# Altium schematic sheet PCBA-2075-01.SchDoc
size Tabloid; ApprovedBy: N. Paiva; Organization: HEBI Robotics; Address1: 3577 Bigelow Blvd.; Address2: Floor 3; Address3: Pittsburgh, PA 15213; Address4: USA
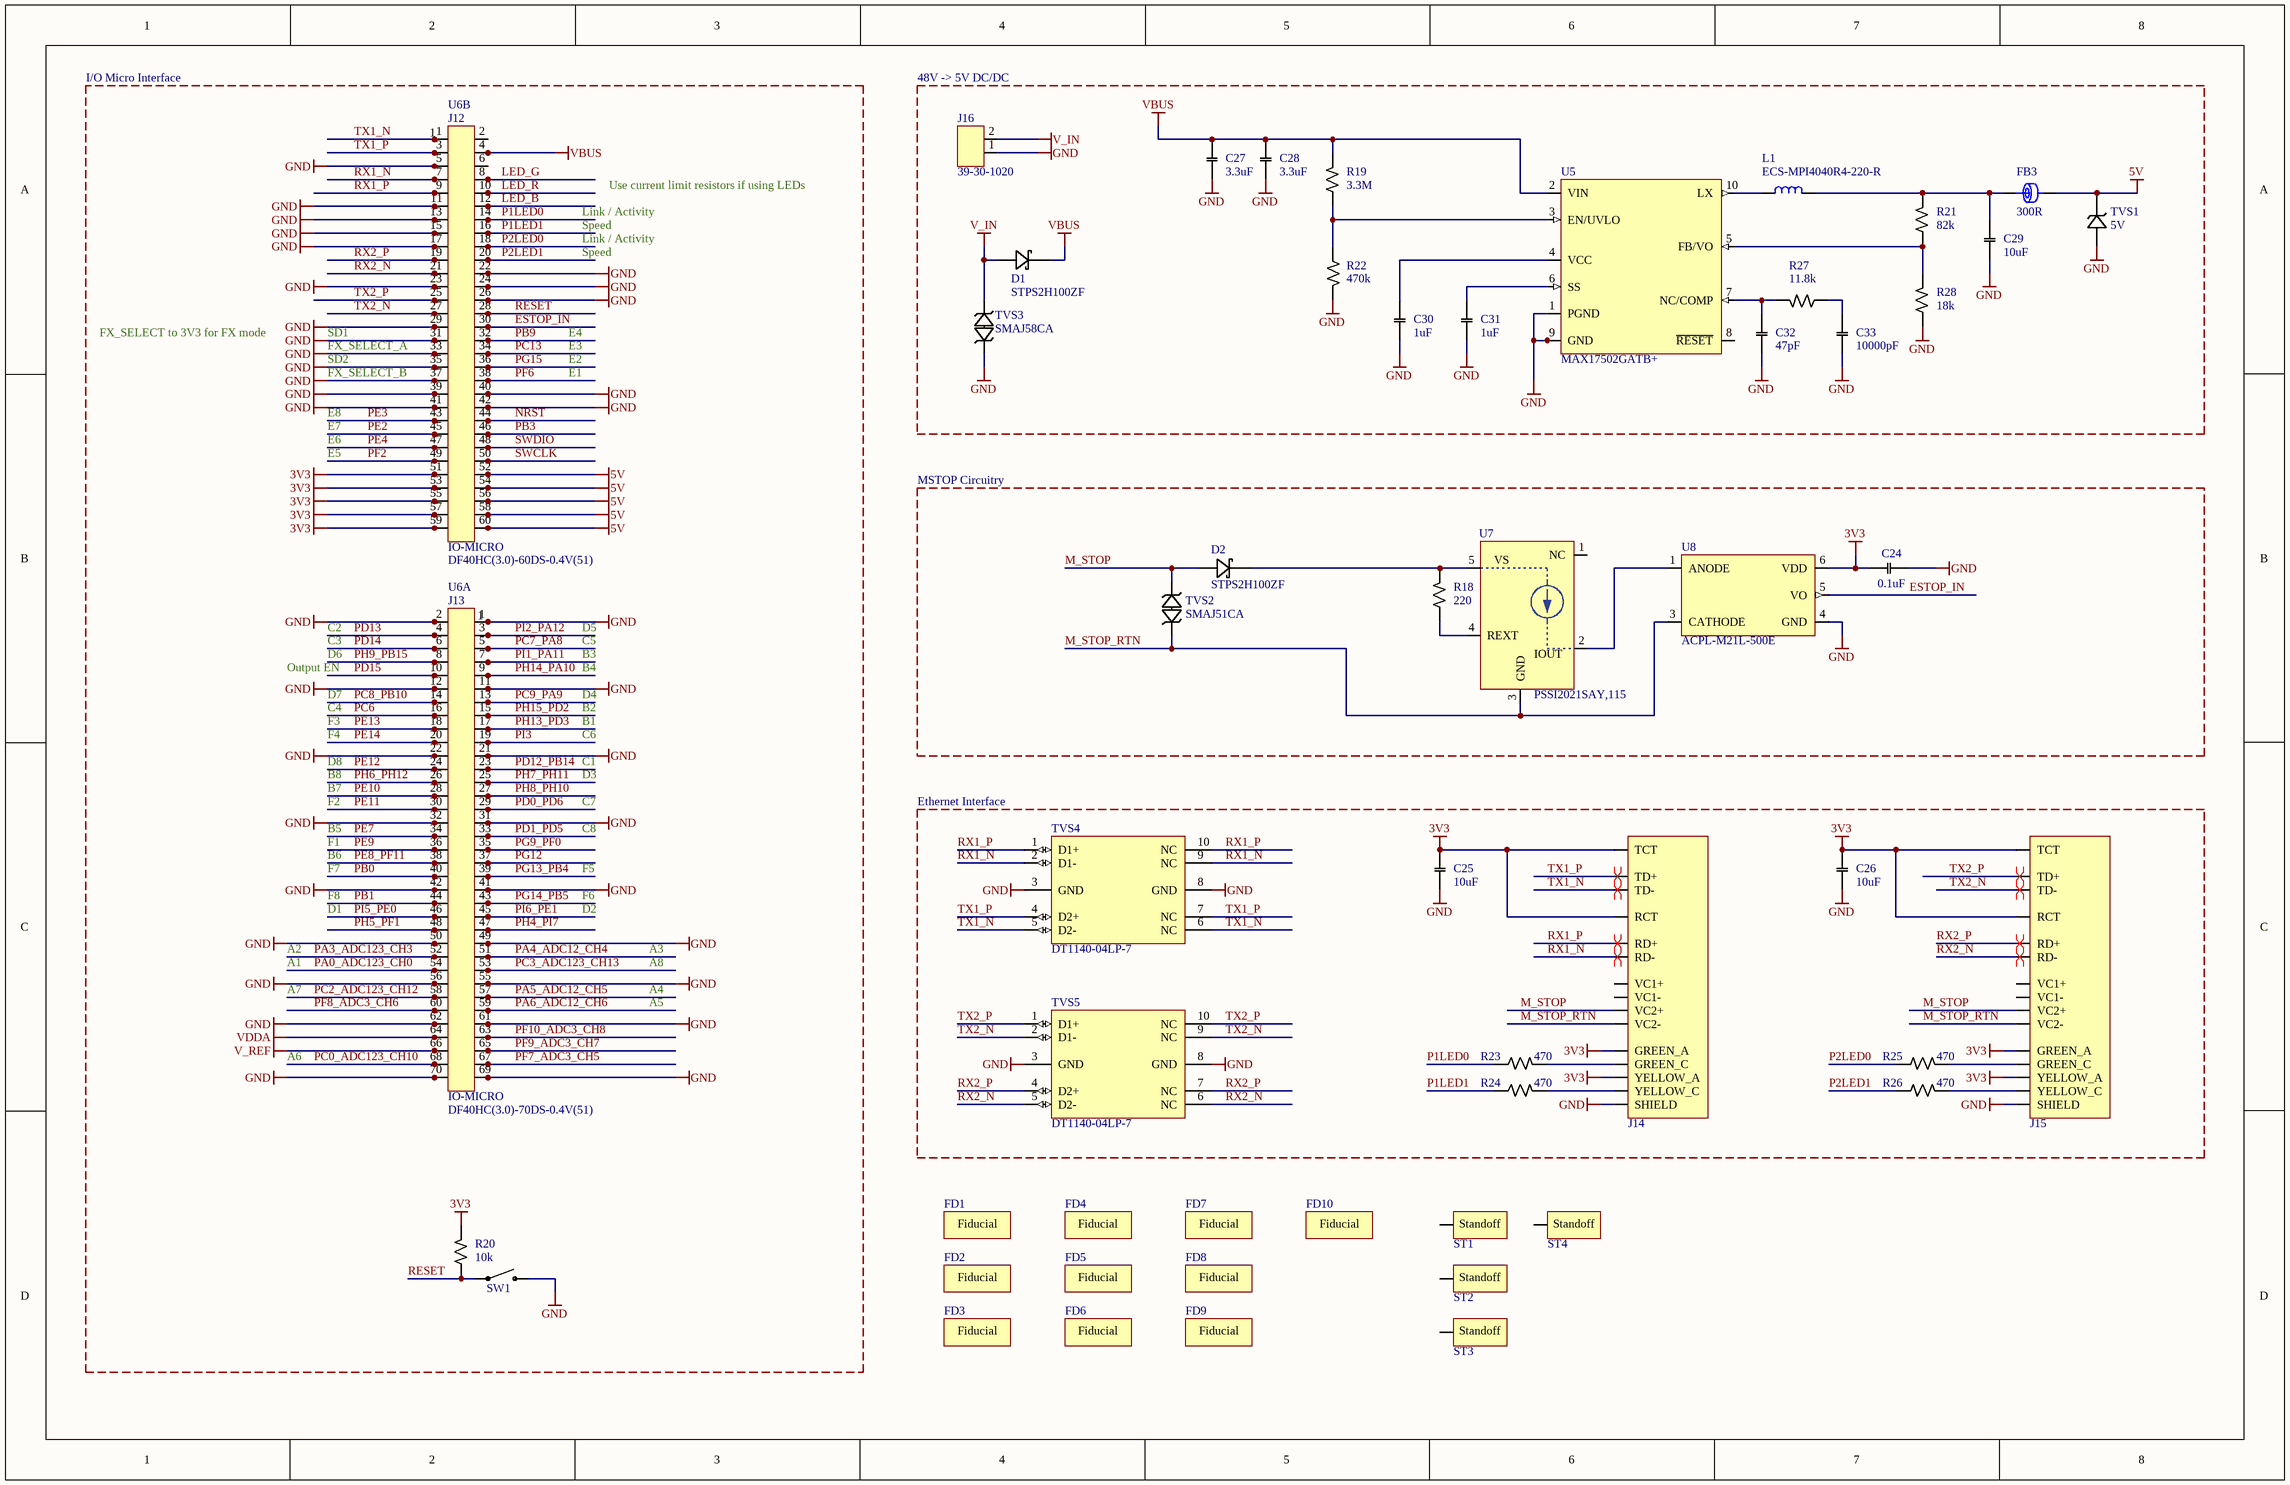
[diagram p0: PCBA-2075-01.SchDoc]

## Parts
C24  Capacitance: 0.1uF  [C0402]  (hidden comment: C-0.1uf-X7R-25V-10%-0402)
C25  Capacitance: 10uF  [C0805]  (hidden comment: C-10uf-X5R-25V-10%-0805)
C26  Capacitance: 10uF  [C0805]  (hidden comment: C-10uf-X5R-25V-10%-0805)
C27  Capacitance: 3.3uF  [C1206]  (hidden comment: C-3.3uf-X7S-100V-10%-1206)
C28  Capacitance: 3.3uF  [C1206]  (hidden comment: C-3.3uf-X7S-100V-10%-1206)
C29  Capacitance: 10uF  [C0603]  (hidden comment: C-10uf-X5R-16V-10%-0603)
C30  Capacitance: 1uF  [C0402]  (hidden comment: C-1uf-X5R-25V-10%-0402)
C31  Capacitance: 1uF  [C0402]  (hidden comment: C-1uf-X5R-25V-10%-0402)
C32  Capacitance: 47pF  [C0402]  (hidden comment: C-47pf-C0G-NP0-50V-5%-0402)
C33  Capacitance: 10000pF  [C0402]  (hidden comment: C-10000pf-X7R-50V-10%-0402)
D1  STPS2H100ZF  [SOD123F_ST]
D2  STPS2H100ZF  [SOD123F_ST]
FB3  Impedance: 300R  [FB0603]  (hidden comment: MI0603L301R-10)
FD1  Fiducial  [New footprint 1]  (value not drawn)  (no BOM)
FD2  Fiducial  [New footprint 1]  (value not drawn)  (no BOM)
FD3  Fiducial  [New footprint 1]  (value not drawn)  (no BOM)
FD4  Fiducial  [New footprint 1]  (value not drawn)  (no BOM)
FD5  Fiducial No Overlay  [New footprint 1]  (value not drawn)  (no BOM)
FD6  Fiducial No Overlay  [New footprint 1]  (value not drawn)  (no BOM)
FD7  Fiducial No Overlay  [New footprint 1]  (value not drawn)  (no BOM)
FD8  Fiducial No Overlay  [New footprint 1]  (value not drawn)  (no BOM)
FD9  Fiducial No Overlay  [New footprint 1]  (value not drawn)  (no BOM)
FD10  Fiducial No Overlay  [New footprint 1]  (value not drawn)  (no BOM)
J12  DF40HC(3.0)-60DS-0.4V(51)  [DF40HC(3.0)-60DS-0.4V(51)]
J13  DF40HC(3.0)-70DS-0.4V(51)  [DF40HC(3.0)-70DS-0.4V(51)]
J14  ARJM11C7-114-BA-EW2  [ARJM11C7-114-BA-EW2-Footprint-1]  (value not drawn)
J15  ARJM11C7-114-BA-EW2  [ARJM11C7-114-BA-EW2-Footprint-1]  (value not drawn)
J16  39-30-1020  [39-30-1020]
L1  ECS-MPI4040R4-220-R  [MPI4040R4]
R18  Resistance: 220  [R0603]  (hidden comment: R-220-1%-0.25w-0603)
R19  Resistance: 3.3M  [R0402]  (hidden comment: R-3.3m-1%-0.063w-0402)
R20  Resistance: 10k  [R0402]  (hidden comment: R-10k-1%-0.063w-0402)
R21  Resistance: 82k  [R0402]  (hidden comment: R-82k-1%-0.063w-0402)
R22  Resistance: 470k  [R0402]  (hidden comment: R-470k-1%-0.063w-0402)
R23  Resistance: 470  [R0402]  (hidden comment: R-470-1%-0.063w-0402)
R24  Resistance: 470  [R0402]  (hidden comment: R-470-1%-0.063w-0402)
R25  Resistance: 470  [R0402]  (hidden comment: R-470-1%-0.063w-0402)
R26  Resistance: 470  [R0402]  (hidden comment: R-470-1%-0.063w-0402)
R27  Resistance: 11.8k  [R0402]  (hidden comment: R-11.8k-1%-0.063w-0402)
R28  Resistance: 18k  [R0402]  (hidden comment: R-18k-1%-0.063w-0402)
ST1  9774030960R  [9774030960R]  (value not drawn)
ST2  9774030960R  [9774030960R]  (value not drawn)
ST3  9774030960R  [9774030960R]  (value not drawn)
ST4  9774030960R  [9774030960R]  (value not drawn)
SW1  222ADVBA  [222ADVBA]  (value not drawn)
TVS1  Voltage - Reverse Standoff (Typ): 5V  [SOD-123W_NXP]  (hidden comment: PTVS5V0S1UR,115)
TVS2  SMAJ51CA  [SMA_BI_BOURNS]
TVS3  SMAJ58CA  [SMA_BI_BOURNS]
TVS4  DT1140-04LP-7  [USON10_TI]
TVS5  DT1140-04LP-7  [USON10_TI]
U5  MAX17502GATB+  [10_TDFN_MAXIM]
U6  IO-MICRO  [IO-MICRO-Footprint-1]  (parts A,B of 2)  (no BOM)
U7  PSSI2021SAY,115  [PSSI2021SAY,115]
U8  ACPL-M21L-500E  [SOT125P700X260-5N]

## Blocks framed on the sheet
48V -> 5V DC/DC: C27-C33 D1 FB3 J16 L1 R19 R21 R22 R27 R28 TVS1 TVS3 U5
MSTOP Circuitry: C24 D2 R18 TVS2 U7 U8
Ethernet Interface: C25 C26 J14 J15 R23-R26 TVS4 TVS5

## Nets
3V3: C24.1 C25.2 C26.2 J12.51 J12.53 J12.55 J12.57 J12.59 J14.4(RCT) J14.9(TCT) J14.L1(GREEN_A) J14.L3(YELLOW_A) J15.4(RCT) J15.9(TCT) J15.L1(GREEN_A) J15.L3(YELLOW_A) R20.2 U6.B51 U6.B53 U6.B55 U6.B57 U6.B59 U8.6(VDD)
5V: FB3.2 J12.52 J12.54 J12.56 J12.58 J12.60 TVS1.C U6.B52 U6.B54 U6.B56 U6.B58 U6.B60
GND: C24.2 C25.1 C26.1 C27.1 C28.1 C29.1 C30.2 C31.1 C32.1 C33.1 J12.5 J12.11 J12.13 J12.15 J12.17 J12.22 J12.23 J12.24 J12.26 J12.29 J12.31 J12.33 J12.35 J12.37 J12.39 J12.40 J12.41 J12.42 J13.1 J13.2 J13.11 J13.12 J13.21 J13.22 J13.31 J13.32 J13.41 J13.42 J13.49 J13.50 J13.55 J13.56 J13.61 J13.62 J13.69 J13.70 J14.SHIELD J15.SHIELD J16.1 R22.2 R28.1 SW1.2 TVS1.A TVS3.C TVS4.3(GND) TVS4.8(GND) TVS5.3(GND) TVS5.8(GND) U5.1(PGND) U5.9(GND) U5.11(GND) U6.A1 U6.A2 U6.A11 U6.A12 U6.A21 U6.A22 U6.A31 U6.A32 U6.A41 U6.A42 U6.A49 U6.A50 U6.A55 U6.A56 U6.A61 U6.A62 U6.A69 U6.A70 U6.B5 U6.B11 U6.B13 U6.B15 U6.B17 U6.B22 U6.B23 U6.B24 U6.B26 U6.B29 U6.B31 U6.B33 U6.B35 U6.B37 U6.B39 U6.B40 U6.B41 U6.B42 U8.4(GND)
V_IN: D1.A J16.2 TVS3.A
V_REF: J13.66 U6.A66
VBUS: C27.2 C28.2 D1.C J12.4 R19.2 U5.2(VIN) U6.B4
VDDA: J13.64 U6.A64
ESTOP_IN: J12.30 U6.B30 U8.5(VO)
LED_B: J12.12 U6.B12
LED_G: J12.8 U6.B8
LED_R: J12.10 U6.B10
M_STOP: D2.A J14.6(VC2+) J15.6(VC2+) TVS2.C
M_STOP_RTN: J14.1(VC2-) J15.1(VC2-) TVS2.A U7.3(GND) U8.3(CATHODE)
NRST: J12.44 U6.B44
P1LED0: J12.14 R23.1 U6.B14
P1LED1: J12.16 R24.1 U6.B16
P2LED0: J12.18 R25.1 U6.B18
P2LED1: J12.20 R26.1 U6.B20
PA0_ADC123_CH0: J13.54 U6.A54
PA3_ADC123_CH3: J13.52 U6.A52
PA4_ADC12_CH4: J13.51 U6.A51
PA5_ADC12_CH5: J13.57 U6.A57
PA6_ADC12_CH6: J13.59 U6.A59
PB0: J13.40 U6.A40
PB1: J13.44 U6.A44
PB3: J12.46 U6.B46
PB9: J12.32 U6.B32
PC0_ADC123_CH10: J13.68 U6.A68
PC2_ADC123_CH12: J13.58 U6.A58
PC3_ADC123_CH13: J13.53 U6.A53
PC6: J13.16 U6.A16
PC7_PA8: J13.5 U6.A5
PC8_PB10: J13.14 U6.A14
PC9_PA9: J13.13 U6.A13
PC13: J12.34 U6.B34
PD0_PD6: J13.29 U6.A29
PD1_PD5: J13.33 U6.A33
PD12_PB14: J13.23 U6.A23
PD13: J13.4 U6.A4
PD14: J13.6 U6.A6
PD15: J13.10 U6.A10
PE2: J12.45 U6.B45
PE3: J12.43 U6.B43
PE4: J12.47 U6.B47
PE7: J13.34 U6.A34
PE8_PF11: J13.38 U6.A38
PE9: J13.36 U6.A36
PE10: J13.28 U6.A28
PE11: J13.30 U6.A30
PE12: J13.24 U6.A24
PE13: J13.18 U6.A18
PE14: J13.20 U6.A20
PF2: J12.49 U6.B49
PF6: J12.38 U6.B38
PF7_ADC3_CH5: J13.67 U6.A67
PF8_ADC3_CH6: J13.60 U6.A60
PF9_ADC3_CH7: J13.65 U6.A65
PF10_ADC3_CH8: J13.63 U6.A63
PG9_PF0: J13.35 U6.A35
PG12: J13.37 U6.A37
PG13_PB4: J13.39 U6.A39
PG14_PB5: J13.43 U6.A43
PG15: J12.36 U6.B36
PH4_PI7: J13.47 U6.A47
PH5_PF1: J13.48 U6.A48
PH6_PH12: J13.26 U6.A26
PH7_PH11: J13.25 U6.A25
PH8_PH10: J13.27 U6.A27
PH9_PB15: J13.8 U6.A8
PH13_PD3: J13.17 U6.A17
PH14_PA10: J13.9 U6.A9
PH15_PD2: J13.15 U6.A15
PI1_PA11: J13.7 U6.A7
PI2_PA12: J13.3 U6.A3
PI3: J13.19 U6.A19
PI5_PE0: J13.46 U6.A46
PI6_PE1: J13.45 U6.A45
RESET: J12.28 R20.1 SW1.1 U6.B28
RX1_N: J12.7 J14.3(RD-) TVS4.2(D1-) TVS4.9(NC) U6.B7
RX1_P: J12.9 J14.5(RD+) TVS4.1(D1+) TVS4.10(NC) U6.B9
RX2_N: J12.21 J15.3(RD-) TVS5.5(D2-) TVS5.6(NC) U6.B21
RX2_P: J12.19 J15.5(RD+) TVS5.4(D2+) TVS5.7(NC) U6.B19
SWCLK: J12.50 U6.B50
SWDIO: J12.48 U6.B48
TX1_N: J12.1 J14.8(TD-) TVS4.5(D2-) TVS4.6(NC) U6.B1
TX1_P: J12.3 J14.10(TD+) TVS4.4(D2+) TVS4.7(NC) U6.B3
TX2_N: J12.27 J15.8(TD-) TVS5.2(D1-) TVS5.9(NC) U6.B27
TX2_P: J12.25 J15.10(TD+) TVS5.1(D1+) TVS5.10(NC) U6.B25
NetC29_2: C29.2 FB3.1 L1.2 R21.2
NetC30_1: C30.1 U5.4(VCC)
NetC31_2: C31.2 U5.6(SS)
NetC32_2: C32.2 R27.2 U5.7(NC/COMP)
NetC33_2: C33.2 R27.1
NetD2_C: D2.C R18.2 U7.5(VS)
NetJ12_2: J12.2 U6.B2
NetJ12_6: J12.6 U6.B6
NetJ14_L2: J14.L2(GREEN_C) R23.2
NetJ14_L4: J14.L4(YELLOW_C) R24.2
NetJ15_L2: J15.L2(GREEN_C) R25.2
NetJ15_L4: J15.L4(YELLOW_C) R26.2
NetL1_1: L1.1 U5.10(LX)
NetR18_1: R18.1 U7.4(REXT)
NetR19_1: R19.1 R22.1 U5.3(EN/UVLO)
NetR21_1: R21.1 R28.2 U5.5(FB/VO)
NetU7_2: U7.2(IOUT) U8.1(ANODE)

Not connected (* = marked no-connect by the designer): J14 2(VC1-) 7(VC1+); J15 2(VC1-) 7(VC1+); ST1 1; ST2 1; ST3 1; ST4 1; U5 8(~{RESET}); U7 1(NC)

## Layout directives
differential pair: RX1_N, RX1_P, RX2_N, RX2_P, TX1_N, TX1_P, TX2_N, TX2_P

## Notes on the sheet
- I/O Micro Interface
- Link / Activity
- Speed
- Use current limit resistors if using LEDs
- FX_SELECT to 3V3 for FX mode
- SD1
- FX_SELECT_A
- SD2
- E2
- E3
- E4
- FX_SELECT_B
- E7
- E8
- E1
- E5
- E6
- C2
- D5
- Output EN
- C3
- D6
- D7
- B3
- B4
- C5
- D4
- C4
- D8
- F4
- F3
- B1
- B2
- C1
- C6
- B5
- B7
- B8
- F2
- C7
- C8
- D3
- B6
- F8
- F7
- F1
- F6
- F5
- A1
- A2
- D1
- D2
- A3
- A8
- A7
- A4
- A5
- A6
- Title
- Size:
- Date:
- Tabloid
- Number:
- Time:
- Revision:
- Sheet
- of
- File:
- (in symbol CMP-504-0002-2) Standoff
- (in symbol CMP-00829-2) Fiducial

## Library data of the parts
C24 = CMP-00040-11: Capacitor Ceramic 0.1uF 25V X7R 10% SMD 0402; Tolerance: 10%; Voltage - Rated: 25V; Temperature Coefficient: X7R; Package / Case: 0402; Operating Temperature: -55°C ~ 125°C
C25 C26 = CMP-00042-6: Capacitor Ceramic 10uF 25V X5R 10% SMD 0805; Tolerance: 10%; Voltage - Rated: 25V; Temperature Coefficient: X5R; Operating Temperature: -55°C ~ 85°C; Package / Case: 0805
C27 C28 = C-3.3uf-X7S-100V-10%-1206-5: Capacitor Ceramic 3.3uF 100V X7S 10% SMD 1206; Tolerance: ±10%; Voltage - Rated: 100V; Temperature Coefficient: X7S; Package / Case: 1206; Operating Temperature: -55°C ~ 125°C
C29 = CMP-00102-2: Capacitor Ceramic 10uF 16V X5R 10% SMD 0603; Tolerance: 10%; Voltage - Rated: 16V; Temperature Coefficient: X5R; Operating Temperature: -55°C ~ 85°C; Package / Case: 0603
C30 C31 = C-1uf-X5R-25V-10%-0402-8: Capacitor Ceramic 1uF 25V X5R 10% SMD 0402; Tolerance: ±10%; Voltage - Rated: 25V; Temperature Coefficient: X5R; Operating Temperature: -55°C ~ 85°C; Package / Case: 0402
C32 = CMP-00709-5: Capacitor Ceramic 47pF 50V C0G, NP0 5% SMD 0402; Temperature Coefficient: C0G, NP0; Tolerance: ±5%; Package / Case: 0402; Voltage - Rated: 50V; Operating Temperature: -55°C ~ 125°C
C33 = CMP-00041-8: Capacitor Ceramic 10000pF 50V X7R 10% SMD 0402; Operating Temperature: -55°C ~ 125°C; Temperature Coefficient: X7R; Voltage - Rated: 50V; Tolerance: 10%; Package / Case: 0402
D1 D2 = CMP-698-0010-3: DIODE SCHOTTKY 100V 2A SOD123F; Speed: Fast Recovery =< 500ns, > 200mA (Io); Diode Type: Schottky; Part Status: Active; Supplier Device Package: SOD-123F; Category: Discrete Semiconductor Products; Package / Case: SOD-123F; Capacitance @ Vr, F: -; ComponentLink1URL: http://www.st.com/content/ccc/resource/technical/document/datasheet/group3/e0/1c/dc/bb/11/47/42/2a/DM00321023/files/DM00321023.pdf/jcr:content/translations/en.DM00321023.pdf; Operating Temperature - Junction: -40°C ~ 175°C; ComponentLink1Description: Datasheet; Mounting Type: Surface Mount; Current - Average Rectified (Io): 2A; Lead Free Status / RoHS Status: RoHS Compliant
FB3 = CMP-00716-2: FERRITE BEAD 300 OHM 0603 2A; DC Resistance (DCR): 100mR; Test Frequency: 100MHz; Number of Lines: 1; Packaging: Tape and Reel; Frequency: 100MHz; Case Code (Metric): 1608; Core Material: Ferrite; Case Code (Imperial): 0603; Max Current Rating: 2A; Max DC Current: 2A; Weight: 0.00201oz; Series: MI; Width: 0.5mm; REACH SVHC: Unknown; Lead Free: Lead Free; Depth: 0.8mm; Height: 0.037inch; Case/Package: 0603; Package Quantity: 1; Max Operating Temperature: 125°C; Length: 1.6mm; Contact Plating: Tin,Matte; Min Operating Temperature: -40°C; RoHS Compliant: Yes; Mount: Surface Mount; Termination: SMD/SMT
FD1-FD4 = CMP-00828-3: Fiducial with Overlay
FD5-FD10 = CMP-00829-2: Fiducial without Overlay
J12 = CMP-00492-3: CONN RCPT 60POS 0.4MM SMD GOLD; Connector Type: Receptacle; Mated Stacking Heights: 3mm; Number of Contacts: 60; Pitch: 0.016inch; Manufacturer Part Number: DF40HC(3.0)-60DS-0.4V(51); Case/Package: Metal; Contact Material: Bronze; Contact Plating: Gold; Gender: Receptacle; Mount: Surface Mount; Number of Positions: 60; Number of Rows: 2; Package Quantity: 3000; Packaging: Tape and Reel; REACH SVHC: No SVHC; Stack Height: 3mm; Termination: SMD/SMT
J13 = CMP-00491-1: CONN RCPT 70POS 0.4MM SMD GOLD; Manufacturer: Hirose; Manufacturer Part Number: DF40HC(3.0)-70DS-0.4V(51); Lead Free Status / RoHS Status: RoHS Compliant; ComponentLink1Description: Datasheet; ComponentLink1URL: https://www.hirose.com/product/document?clcode=CL0684-4003-3-51&productname=DF40C-60DP-0.4V(51)&series=DF40&documenttype=Catalog&lang=en&documentid=D31649_en
J14 J15 = CMP-00104-1: 1 Port RJ45 Magjack Connector Through Hole 10/100 Base-T, AutoMDIX, Power over Ethernet (PoE); Direction: Up; Number of Cores per Jack: 4; Number of Ports: 1; Shielding: Shielded; Color: Green,Yellow; Connector Type: RJ45; Contact Plating: Gold; Max Operating Temperature: 85°C; Min Operating Temperature: -40°C; Mount: Through Hole; Number of Rows: 1; Packaging: Tray; Termination: Solder
J16 = CMP-00288-1: CONN HEADER 2POS 4.2MM R/A TIN; Manufacturer: Molex Inc; Connector Type: Header, Shrouded; Number of Positions: 2; Number of Positions Loaded: All; Row Spacing: 0.165" (4.20mm); Manufacturer Part Number: 39-30-1020; Lead Free Status / RoHS Status: RoHS Compliant; ComponentLink1Description: Datasheet; ComponentLink1URL: http://www.molex.com/pdm_docs/sd/039301020_sd.pdf; Category: Connectors, Interconnects; Mounting Type: Through Hole, Right Angle; Termination: Solder; Features: Board Lock; Color: Natural; Contact Type: Male Pin; Pitch: -; Number of Rows: 2; Contact Mating Length: -; Fastening Type: Locking Ramp; Contact Finish: Tin; Contact Finish Thickness: 100µin (2.54µm)
L1 = CMP-00364-3: FIXED IND 22UH 1.3A 316 MOHM SMD; Tolerance: ±20%; Current - Saturation: 1.8A; Shielding: Shielded; ComponentLink1Description: Datasheet; ComponentLink1URL: https://www.ecsxtal.com/store/pdf/ECS-MPI4040.pdf; Q @ Freq: -; Material - Core: -; Mounting Type: Surface Mount; Part Status: Active; Package / Case: Nonstandard; DC Resistance (DCR): 316 mOhm; Operating Temperature: -55°C ~ 125°C; Supplier Device Package: -; Frequency - Self Resonant: -; Features: -; Lead Free Status / RoHS Status: RoHS Compliant; Type: -; Size / Dimension: 0.175" L x 0.160" W (4.45mm x 4.06mm); Ratings: AEC-Q200; Height - Seated (Max): 0.079" (2.00mm); Category: Inductors, Coils, Chokes
R18 = CMP-00175-3: Resistor 0603 220 Ohm 1% 1-4 Watt; Power: 0.25W, 1/4W; Part Name: R-220-1%-0.25w-0603; Tolerance (%): ±1%; Package / Case: 0603
R19 = CMP-00141-4: Resistor 0402 3.3m Ohm 1% 1-16 Watt; Power: 0.063W, 1/16W; Package / Case: 0402; Part Name: R-3.3m-1%-0.063w-0402; Tolerance (%): ±1%
R20 = CMP-00015-10: Resistor 0402 10k Ohm 1% 1-16 Watt; Power: 0.063W, 1/16W; Package: 0402; Tolerance: 1%
R21 = CMP-00708-2: Resistor 0402 82k Ohm 1% 1-16 Watt; Power: 0.063W, 1/16W; Part Name: R-82k-1%-0.063w-0402; Tolerance (%): ±1%; Package / Case: 0402
R22 = CMP-00804-1: Resistor 0402 470k Ohm 1% 1-16 Watt; Power: 0.063W, 1/16W; Package: 0402; Tolerance: 1%
R23-R26 = CMP-00097-2: Resistor 0402 470 Ohm 1% 1-16 Watt; Power: 0.063W, 1/16W; Package: 0402; Tolerance: 1%
R27 = CMP-00120-3: Resistor 0402 11.8k Ohm 1% 1-16 Watt; Power: 0.063W, 1/16W; Part Name: R-11.8k-1%-0.063w-0402; Tolerance (%): ±1%; Package / Case: 0402
R28 = CMP-00618-2: Resistor 0402 18k Ohm 1% 1-16 Watt; Power: 0.063W, 1/16W; Tolerance: 1%; Package: 0402
ST1-ST4 = CMP-504-0002-2: ROUND SPACER M3.3 STEEL 3MM; Manufacturer: Wurth Electronics Inc; Threaded/Unthreaded: Unthreaded; Between Board Height: 0.118" (3.00mm); Plating: Tin; Manufacturer Part Number: 9774030960R; Lead Free Status / RoHS Status: RoHS Compliant; ComponentLink1Description: Datasheet; ComponentLink1URL: http://katalog.we-online.de/em/datasheet/9774030960R.pdf; Category: Hardware, Fasteners, Accessories; Type: Round Spacer; Gender: -; Screw, Thread Size: M3.3; Diameter - Inside: 0.130" (3.30mm); Diameter - Outside: 0.236" (6.00mm); Length - Overall: 0.173" (4.39mm); Features: Surface Mount; Material: Steel; Color: -; Weight: -
SW1 = CMP-00538-1: Tactile Switch SPST-NO Top Actuated Through Hole; Manufacturer: CTS; Switch Function: Off-Mom; Actuator Type: Standard; Operating Force: 160gf; Switch Travel: 0.25mm; Mechanical Life: 1000000Cycles; Throw Configuration: SPST; Illumination Type: Non-Illuminated; Manufacturer Part Number: 222ADVBA; Lead Free Status / RoHS Status: RoHS Compliant; ComponentLink1Description: Datasheet; ComponentLink1URL: https://www.ctscorp.com/wp-content/uploads/222A.pdf; Mount: Through Hole; Min Operating Temperature: -40°C; Max Operating Temperature: 85°C; Termination: PC Pin
TVS1 = CMP-00453-3: TVS DIODE 5VWM 9.2VC SOD123W; Unidirectional Channels: 1; Voltage - Breakdown (Min): 6.4V; Voltage - Clamping (Max) @ Ipp: 9.2V; Current - Peak Pulse (10/1000µs): 43.5A; Power - Peak Pulse: 400W; Power Line Protection: No; Lead Free Status / RoHS Status: RoHS Compliant; ComponentLink1Description: Datasheet; ComponentLink1URL: http://www.nxp.com/documents/data_sheet/PTVSXS1UR_SER.pdf; Category: Circuit Protection; Type: Zener; Bidirectional Channels: -; Applications: Automotive; Capacitance @ Frequency: -; Operating Temperature: -55°C ~ 150°C (TA); Mounting Type: Surface Mount; Package / Case: SOD-123W; Supplier Device Package: SOD123W
TVS2 = CMP-00457-3: TVS DIODE 51VWM 82.4VC DO214AC; Voltage - Reverse Standoff (Typ): 51V; Voltage - Breakdown (Min): 56.7V; Voltage - Clamping (Max) @ Ipp: 82.4V; Current - Peak Pulse (10/1000µs): 4.9A; Power - Peak Pulse: 400W; Power Line Protection: No; Bidirectional Channels: 1; Lead Free Status / RoHS Status: RoHS Compliant; ComponentLink1Description: Datasheet; ComponentLink1URL: http://www.bourns.com/docs/Product-Datasheets/SMAJ.pdf; Category: Circuit Protection; Type: Zener; Applications: General Purpose; Capacitance @ Frequency: -; Operating Temperature: -55°C ~ 150°C (TJ); Mounting Type: Surface Mount; Package / Case: DO-214AC, SMA; Supplier Device Package: SMA (DO-214AC); Part Status: Active; Packaging: Cut Tape (CT)
TVS3 = CMP-00443-3: TVS DIODE 58VWM 93.6VC SMA; Bidirectional Channels: 1; Voltage - Breakdown (Min): 64.4V; Voltage - Reverse Standoff (Typ): 58V; Current - Peak Pulse (10/1000µs): 4.3A; Power - Peak Pulse: 400W; Voltage - Clamping (Max) @ Ipp: 93.6V; Power Line Protection: No; Supplier Device Package: SMA (DO-214AC); Operating Temperature: -55°C ~ 150°C (TJ); Part Status: Active; ComponentLink1Description: Datasheet; Capacitance @ Frequency: -; Packaging: Cut Tape (CT); ComponentLink1URL: http://www.bourns.com/data/global/pdfs/SMAJ.pdf; Type: Zener; Applications: General Purpose; Package / Case: DO-214AC, SMA; Unidirectional Channels: -; Category: Circuit Protection; Mounting Type: Surface Mount; Lead Free Status / RoHS Status: RoHS Compliant
TVS4 TVS5 = CMP-00675-5: TVS DIODE 5.5V 10V U-DFN2510-10; Direction: Unidirectional; Min Breakdown Voltage: 6V; Number of Bidirectional Channels: 4; Peak Pulse Current: 6A; Peak Pulse Power: 350mW; Power Line Protection: Yes; Max Reverse Leakage Current: 500nA; Test Current: 1mA; Clamping Voltage: 10V; Length: 2.58mm; Max Operating Temperature: 85°C; Min Operating Temperature: -55°C; Mount: Surface Mount; Number of Pins: 10; Package Quantity: 1; Packaging: Tape and Reel; Radiation Hardening: No; Reverse Standoff Voltage: 5.5V; Case/Package: DFN; ComponentLink1Description: Datasheet; ComponentLink1URL: https://www.diodes.com/assets/Datasheets/DT1140-04LP.pdf; ESD Protection: Yes; Height: 0.555mm; RoHS Compliant: Yes; Width: 1.075mm
U5 = CMP-452-0020-4: Switching Voltage Regulators 60V 1A 600kHz Synch Step-Down Regulator; Nominal Supply Current: 4.75mA; Output Type: Adjustable; Max Output Voltage: 55.2V; Efficiency: 90%; Synchronous Rectifier: Yes; Min Supply Voltage: 4.5V; Min Output Voltage: 900mV; Number of Outputs: 1; ComponentLink1Description: Datasheet; Min Operating Temperature: -40°C; Max Output Current: 1A; Length: 3.1mm; Number of Pins: 10; ComponentLink1URL: http://datasheets.maximintegrated.com/en/ds/MAX17502.pdf; Width: 2.1mm; Output Current: 1A; Switching Frequency: 600kHz; Output Voltage: 55.2V; Operating Supply Voltage: 60V; Max Operating Temperature: 125°C; Series: -; Packaging: Rail/Tube; Min Input Voltage: 4.5V; Height: 0.75mm; Max Input Voltage: 60V; Package Quantity: 1
U6 = CMP-00789-8: IO Micro Composite Component; PartId: 1
U7 = CMP-631-0001-1: IC CURRENT SOURCE SOT353; Current - Output / Channel: 50mA - 15uA; Manufacturer Part Number: PSSI2021SAY,115; ComponentLink1URL: https://assets.nexperia.com/documents/data-sheet/PSSI2021SAY.pdf; ComponentLink1Description: Datasheet
U8 = CMP-636-0002-2: OPTOISO 3.75KV PUSH PULL 5SO; Number of Channels: 1; Input Type: DC; Output Type: PUSH-PULL; Direction: Unidirectional; Fall Time: 11ns; Forward Current: 2.2mA; Forward Voltage: 1.5V; Input Current: 6mA; Max Input Current: 8mA; Max Output Current: 10mA; Max Power Dissipation: 600mW; Propagation Delay: 250ns; Reverse Breakdown Voltage: 5V; Case/Package: SO; Isolation Voltage: 3.75kV; Max Operating Temperature: 105°C; Min Operating Temperature: -40°C; Mount: Surface Mount; Number of Elements: 1; Number of Pins: 5; Output Current: 10mA; Output Current per Channel: 10mA; Package Quantity: 1500; Packaging: Tape and Reel; Power Dissipation: 600mW; Radiation Hardening: No; REACH SVHC: No SVHC; Rise Time: 11ns; Series: -; Turn-On Delay Time: 250ns